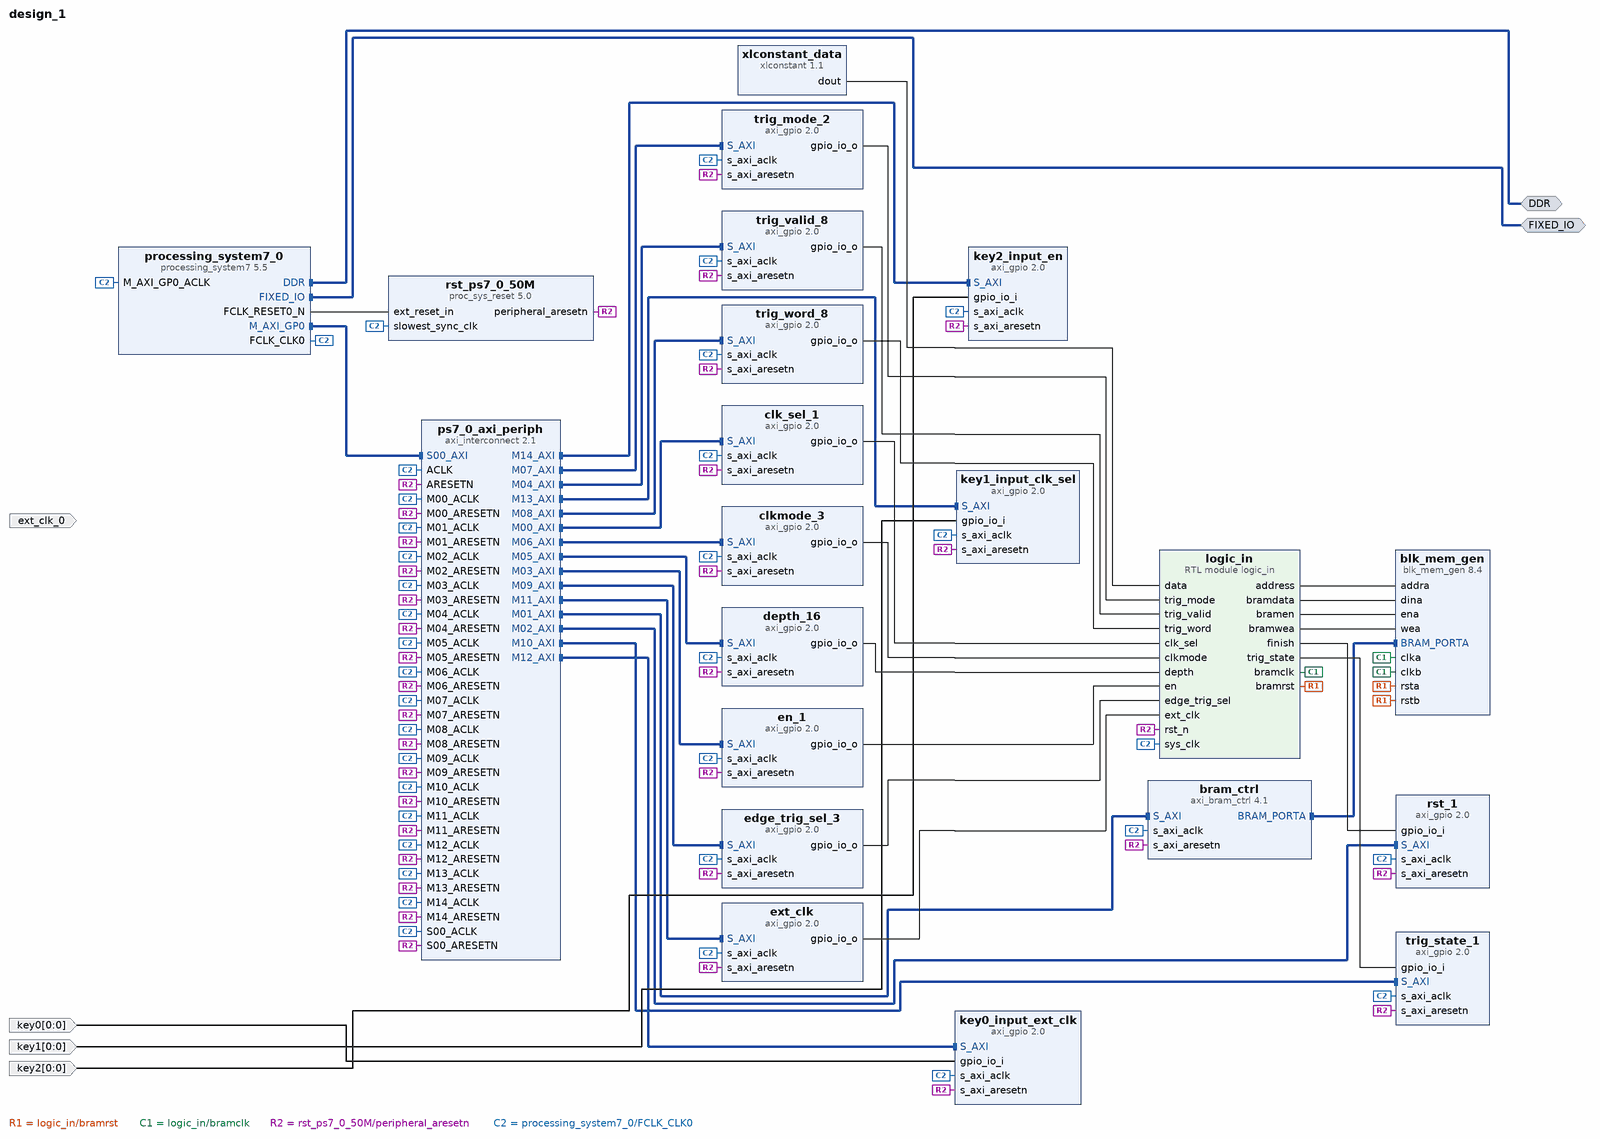
[diagram p0: block diagram of the top level]
# Vivado block design design_1, xc7z020clg400-1, Vivado 2018.3
create_bd_design design_1

create_bd_intf_port -mode Master -vlnv xilinx.com:interface:ddrx_rtl:1.0 DDR
create_bd_intf_port -mode Master -vlnv xilinx.com:display_processing_system7:fixedio_rtl:1.0 FIXED_IO
create_bd_port -dir I -type clk ext_clk_0
create_bd_port -dir I -from 0 -to 0 key0
create_bd_port -dir I -from 0 -to 0 key1
create_bd_port -dir I -from 0 -to 0 key2

create_bd_cell -type ip -vlnv xilinx.com:ip:blk_mem_gen:8.4 blk_mem_gen
set_property -dict [list \
  CONFIG.EN_SAFETY_CKT false \
  CONFIG.Enable_B Use_ENB_Pin \
  CONFIG.Memory_Type True_Dual_Port_RAM \
  CONFIG.Port_B_Clock 100 \
  CONFIG.Port_B_Enable_Rate 100 \
  CONFIG.Port_B_Write_Rate 50 \
  CONFIG.Use_RSTB_Pin true \
] [get_bd_cells blk_mem_gen]
create_bd_cell -type module -reference logic_in logic_in
create_bd_cell -type ip -vlnv xilinx.com:ip:axi_gpio:2.0 clk_sel_1
set_property -dict {CONFIG.C_ALL_OUTPUTS 1 CONFIG.C_GPIO_WIDTH 1} [get_bd_cells clk_sel_1]
create_bd_cell -type ip -vlnv xilinx.com:ip:processing_system7:5.5 processing_system7_0
set_property -dict [list \
  CONFIG.PCW_APU_PERIPHERAL_FREQMHZ 650 \
  CONFIG.PCW_CRYSTAL_PERIPHERAL_FREQMHZ 50 \
  CONFIG.PCW_ENET0_ENET0_IO {MIO 16 .. 27} \
  CONFIG.PCW_ENET0_GRP_MDIO_ENABLE 1 \
  CONFIG.PCW_ENET0_GRP_MDIO_IO {MIO 52 .. 53} \
  CONFIG.PCW_ENET0_PERIPHERAL_ENABLE 1 \
  CONFIG.PCW_ENET0_RESET_ENABLE 1 \
  CONFIG.PCW_ENET0_RESET_IO {MIO 9} \
  CONFIG.PCW_ENET_RESET_ENABLE 1 \
  CONFIG.PCW_ENET_RESET_SELECT {Share reset pin} \
  CONFIG.PCW_FPGA0_PERIPHERAL_FREQMHZ 100 \
  CONFIG.PCW_FPGA1_PERIPHERAL_FREQMHZ 50 \
  CONFIG.PCW_GPIO_MIO_GPIO_ENABLE 1 \
  CONFIG.PCW_GPIO_MIO_GPIO_IO MIO \
  CONFIG.PCW_I2C_RESET_ENABLE 0 \
  CONFIG.PCW_M_AXI_GP0_FREQMHZ 10 \
  CONFIG.PCW_PERIPHERAL_BOARD_PRESET None \
  CONFIG.PCW_PRESET_BANK1_VOLTAGE {LVCMOS 1.8V} \
  CONFIG.PCW_QSPI_GRP_FBCLK_ENABLE 1 \
  CONFIG.PCW_QSPI_GRP_FBCLK_IO {MIO 8} \
  CONFIG.PCW_QSPI_GRP_SINGLE_SS_ENABLE 1 \
  CONFIG.PCW_QSPI_GRP_SINGLE_SS_IO {MIO 1 .. 6} \
  CONFIG.PCW_QSPI_PERIPHERAL_ENABLE 1 \
  CONFIG.PCW_QSPI_QSPI_IO {MIO 1 .. 6} \
  CONFIG.PCW_SD0_GRP_CD_ENABLE 1 \
  CONFIG.PCW_SD0_GRP_CD_IO {MIO 47} \
  CONFIG.PCW_SD0_GRP_WP_ENABLE 0 \
  CONFIG.PCW_SD0_PERIPHERAL_ENABLE 1 \
  CONFIG.PCW_SD0_SD0_IO {MIO 40 .. 45} \
  CONFIG.PCW_SDIO_PERIPHERAL_FREQMHZ 50 \
  CONFIG.PCW_SINGLE_QSPI_DATA_MODE x4 \
  CONFIG.PCW_UART0_PERIPHERAL_ENABLE 1 \
  CONFIG.PCW_UART0_UART0_IO {MIO 14 .. 15} \
  CONFIG.PCW_UART1_PERIPHERAL_ENABLE 0 \
  CONFIG.PCW_UART_PERIPHERAL_FREQMHZ 100 \
  CONFIG.PCW_UIPARAM_DDR_BUS_WIDTH {16 Bit} \
  CONFIG.PCW_UIPARAM_DDR_FREQ_MHZ 525 \
  CONFIG.PCW_UIPARAM_DDR_PARTNO {MT41J256M16 RE-125} \
  CONFIG.PCW_USB0_PERIPHERAL_ENABLE 1 \
  CONFIG.PCW_USB0_RESET_ENABLE 1 \
  CONFIG.PCW_USB0_RESET_IO {MIO 46} \
  CONFIG.PCW_USB0_USB0_IO {MIO 28 .. 39} \
  CONFIG.PCW_USB_RESET_ENABLE 1 \
  CONFIG.PCW_USB_RESET_SELECT {Share reset pin} \
] [get_bd_cells processing_system7_0]
# 491 more settings of processing_system7_0 are not shown: defaults, MIO pin electricals, DDR timing, and values the tool derives
create_bd_cell -type ip -vlnv xilinx.com:ip:axi_interconnect:2.1 ps7_0_axi_periph
set_property -dict {CONFIG.NUM_MI 15} [get_bd_cells ps7_0_axi_periph]
create_bd_cell -type ip -vlnv xilinx.com:ip:proc_sys_reset:5.0 rst_ps7_0_50M
create_bd_cell -type ip -vlnv xilinx.com:ip:axi_bram_ctrl:4.1 bram_ctrl
set_property -dict {CONFIG.SINGLE_PORT_BRAM 1} [get_bd_cells bram_ctrl]
create_bd_cell -type ip -vlnv xilinx.com:ip:axi_gpio:2.0 rst_1
set_property -dict {CONFIG.C_ALL_INPUTS 1 CONFIG.C_GPIO_WIDTH 1} [get_bd_cells rst_1]
create_bd_cell -type ip -vlnv xilinx.com:ip:axi_gpio:2.0 en_1
set_property -dict {CONFIG.C_ALL_OUTPUTS 1 CONFIG.C_GPIO_WIDTH 1} [get_bd_cells en_1]
create_bd_cell -type ip -vlnv xilinx.com:ip:axi_gpio:2.0 trig_valid_8
set_property -dict {CONFIG.C_ALL_OUTPUTS 1 CONFIG.C_GPIO_WIDTH 8} [get_bd_cells trig_valid_8]
create_bd_cell -type ip -vlnv xilinx.com:ip:axi_gpio:2.0 depth_16
set_property -dict {CONFIG.C_ALL_INPUTS 0 CONFIG.C_ALL_OUTPUTS 1 CONFIG.C_GPIO_WIDTH 16} [get_bd_cells depth_16]
create_bd_cell -type ip -vlnv xilinx.com:ip:axi_gpio:2.0 clkmode_3
set_property -dict {CONFIG.C_ALL_OUTPUTS 1 CONFIG.C_GPIO_WIDTH 3} [get_bd_cells clkmode_3]
create_bd_cell -type ip -vlnv xilinx.com:ip:xlconstant:1.1 xlconstant_data
set_property -dict {CONFIG.CONST_VAL 132 CONFIG.CONST_WIDTH 8} [get_bd_cells xlconstant_data]
create_bd_cell -type ip -vlnv xilinx.com:ip:axi_gpio:2.0 trig_mode_2
set_property -dict {CONFIG.C_ALL_OUTPUTS 1 CONFIG.C_GPIO_WIDTH 2} [get_bd_cells trig_mode_2]
create_bd_cell -type ip -vlnv xilinx.com:ip:axi_gpio:2.0 trig_word_8
set_property -dict {CONFIG.C_ALL_OUTPUTS 1 CONFIG.C_GPIO_WIDTH 8} [get_bd_cells trig_word_8]
create_bd_cell -type ip -vlnv xilinx.com:ip:axi_gpio:2.0 edge_trig_sel_3
set_property -dict {CONFIG.C_ALL_OUTPUTS 1 CONFIG.C_GPIO_WIDTH 3} [get_bd_cells edge_trig_sel_3]
create_bd_cell -type ip -vlnv xilinx.com:ip:axi_gpio:2.0 trig_state_1
set_property -dict {CONFIG.C_ALL_INPUTS 1 CONFIG.C_GPIO_WIDTH 1} [get_bd_cells trig_state_1]
create_bd_cell -type ip -vlnv xilinx.com:ip:axi_gpio:2.0 ext_clk
set_property -dict {CONFIG.C_ALL_OUTPUTS 1 CONFIG.C_GPIO_WIDTH 1} [get_bd_cells ext_clk]
create_bd_cell -type ip -vlnv xilinx.com:ip:axi_gpio:2.0 key0_input_ext_clk
set_property -dict {CONFIG.C_ALL_INPUTS 1 CONFIG.C_GPIO_WIDTH 1} [get_bd_cells key0_input_ext_clk]
create_bd_cell -type ip -vlnv xilinx.com:ip:axi_gpio:2.0 key1_input_clk_sel
set_property -dict {CONFIG.C_ALL_INPUTS 1 CONFIG.C_GPIO_WIDTH 1} [get_bd_cells key1_input_clk_sel]
create_bd_cell -type ip -vlnv xilinx.com:ip:axi_gpio:2.0 key2_input_en
set_property -dict {CONFIG.C_ALL_INPUTS 1 CONFIG.C_GPIO_WIDTH 1} [get_bd_cells key2_input_en]

# ---- connections ----

connect_bd_intf_net [get_bd_intf_pins ps7_0_axi_periph/M06_AXI] [get_bd_intf_pins clkmode_3/S_AXI]
connect_bd_intf_net [get_bd_intf_pins ps7_0_axi_periph/M03_AXI] [get_bd_intf_pins en_1/S_AXI]
connect_bd_intf_net [get_bd_intf_pins processing_system7_0/M_AXI_GP0] [get_bd_intf_pins ps7_0_axi_periph/S00_AXI]
connect_bd_intf_net [get_bd_intf_pins ps7_0_axi_periph/M02_AXI] [get_bd_intf_pins rst_1/S_AXI]
connect_bd_intf_net [get_bd_intf_pins ps7_0_axi_periph/M00_AXI] [get_bd_intf_pins clk_sel_1/S_AXI]
connect_bd_intf_net -intf_net axi_bram_ctrl_0_BRAM_PORTA [get_bd_intf_pins blk_mem_gen/BRAM_PORTA] [get_bd_intf_pins bram_ctrl/BRAM_PORTA]
connect_bd_intf_net [get_bd_intf_ports DDR] [get_bd_intf_pins processing_system7_0/DDR]
connect_bd_intf_net [get_bd_intf_pins ps7_0_axi_periph/M01_AXI] [get_bd_intf_pins bram_ctrl/S_AXI]
connect_bd_intf_net [get_bd_intf_ports FIXED_IO] [get_bd_intf_pins processing_system7_0/FIXED_IO]
connect_bd_intf_net [get_bd_intf_pins ps7_0_axi_periph/M08_AXI] [get_bd_intf_pins trig_word_8/S_AXI]
connect_bd_intf_net [get_bd_intf_pins ps7_0_axi_periph/M04_AXI] [get_bd_intf_pins trig_valid_8/S_AXI]
connect_bd_intf_net [get_bd_intf_pins ps7_0_axi_periph/M09_AXI] [get_bd_intf_pins edge_trig_sel_3/S_AXI]
connect_bd_intf_net [get_bd_intf_pins ps7_0_axi_periph/M07_AXI] [get_bd_intf_pins trig_mode_2/S_AXI]
connect_bd_intf_net [get_bd_intf_pins ps7_0_axi_periph/M10_AXI] [get_bd_intf_pins trig_state_1/S_AXI]
connect_bd_intf_net [get_bd_intf_pins ps7_0_axi_periph/M05_AXI] [get_bd_intf_pins depth_16/S_AXI]
connect_bd_intf_net [get_bd_intf_pins ps7_0_axi_periph/M11_AXI] [get_bd_intf_pins ext_clk/S_AXI]
connect_bd_intf_net [get_bd_intf_pins ps7_0_axi_periph/M12_AXI] [get_bd_intf_pins key0_input_ext_clk/S_AXI]
connect_bd_intf_net [get_bd_intf_pins ps7_0_axi_periph/M13_AXI] [get_bd_intf_pins key1_input_clk_sel/S_AXI]
connect_bd_intf_net [get_bd_intf_pins ps7_0_axi_periph/M14_AXI] [get_bd_intf_pins key2_input_en/S_AXI]
connect_bd_net -net logic_in_0_address [get_bd_pins logic_in/address] [get_bd_pins blk_mem_gen/addra]
connect_bd_net -net logic_in_0_bramdata [get_bd_pins logic_in/bramdata] [get_bd_pins blk_mem_gen/dina]
connect_bd_net -net logic_in_0_bramen [get_bd_pins logic_in/bramen] [get_bd_pins blk_mem_gen/ena]
connect_bd_net -net logic_in_0_bramwea [get_bd_pins logic_in/bramwea] [get_bd_pins blk_mem_gen/wea]
connect_bd_net -net logic_in_0_bramrst [get_bd_pins logic_in/bramrst] [get_bd_pins blk_mem_gen/rsta] [get_bd_pins blk_mem_gen/rstb]
connect_bd_net -net logic_in_0_bramclk [get_bd_pins logic_in/bramclk] [get_bd_pins blk_mem_gen/clka] [get_bd_pins blk_mem_gen/clkb]
connect_bd_net [get_bd_pins processing_system7_0/FCLK_RESET0_N] [get_bd_pins rst_ps7_0_50M/ext_reset_in]
connect_bd_net [get_bd_pins rst_ps7_0_50M/peripheral_aresetn] \
  [get_bd_pins ps7_0_axi_periph/S00_ARESETN] [get_bd_pins clk_sel_1/s_axi_aresetn] [get_bd_pins ps7_0_axi_periph/M00_ARESETN] \
  [get_bd_pins ps7_0_axi_periph/ARESETN] [get_bd_pins bram_ctrl/s_axi_aresetn] [get_bd_pins ps7_0_axi_periph/M01_ARESETN] \
  [get_bd_pins rst_1/s_axi_aresetn] [get_bd_pins ps7_0_axi_periph/M02_ARESETN] [get_bd_pins en_1/s_axi_aresetn] \
  [get_bd_pins ps7_0_axi_periph/M03_ARESETN] [get_bd_pins trig_valid_8/s_axi_aresetn] \
  [get_bd_pins ps7_0_axi_periph/M04_ARESETN] [get_bd_pins depth_16/s_axi_aresetn] [get_bd_pins ps7_0_axi_periph/M05_ARESETN] \
  [get_bd_pins clkmode_3/s_axi_aresetn] [get_bd_pins ps7_0_axi_periph/M06_ARESETN] [get_bd_pins trig_mode_2/s_axi_aresetn] \
  [get_bd_pins ps7_0_axi_periph/M07_ARESETN] [get_bd_pins trig_word_8/s_axi_aresetn] \
  [get_bd_pins ps7_0_axi_periph/M08_ARESETN] [get_bd_pins edge_trig_sel_3/s_axi_aresetn] \
  [get_bd_pins ps7_0_axi_periph/M09_ARESETN] [get_bd_pins logic_in/rst_n] [get_bd_pins trig_state_1/s_axi_aresetn] \
  [get_bd_pins ps7_0_axi_periph/M10_ARESETN] [get_bd_pins ext_clk/s_axi_aresetn] [get_bd_pins ps7_0_axi_periph/M11_ARESETN] \
  [get_bd_pins key0_input_ext_clk/s_axi_aresetn] [get_bd_pins ps7_0_axi_periph/M12_ARESETN] \
  [get_bd_pins key1_input_clk_sel/s_axi_aresetn] [get_bd_pins ps7_0_axi_periph/M13_ARESETN] \
  [get_bd_pins key2_input_en/s_axi_aresetn] [get_bd_pins ps7_0_axi_periph/M14_ARESETN]
connect_bd_net -net axi_gpio_0_gpio_io_o [get_bd_pins clk_sel_1/gpio_io_o] [get_bd_pins logic_in/clk_sel]
connect_bd_net -net axi_gpio_en_gpio_io_o [get_bd_pins en_1/gpio_io_o] [get_bd_pins logic_in/en]
connect_bd_net -net axi_gpio_depth_gpio_io_o [get_bd_pins depth_16/gpio_io_o] [get_bd_pins logic_in/depth]
connect_bd_net -net axi_gpio_clkmode_gpio_io_o [get_bd_pins clkmode_3/gpio_io_o] [get_bd_pins logic_in/clkmode]
connect_bd_net -net axi_gpio_trig_valid_gpio_io_o [get_bd_pins trig_valid_8/gpio_io_o] [get_bd_pins logic_in/trig_valid]
connect_bd_net -net xlconstant_0_dout [get_bd_pins xlconstant_data/dout] [get_bd_pins logic_in/data]
connect_bd_net -net axi_gpio_trig_mode_gpio_io_o [get_bd_pins trig_mode_2/gpio_io_o] [get_bd_pins logic_in/trig_mode]
connect_bd_net -net axi_gpio_0_gpio_io_o2 [get_bd_pins trig_word_8/gpio_io_o] [get_bd_pins logic_in/trig_word]
connect_bd_net -net axi_gpio_trig_sel_gpio_io_o [get_bd_pins edge_trig_sel_3/gpio_io_o] [get_bd_pins logic_in/edge_trig_sel]
connect_bd_net -net logic_in_0_finish [get_bd_pins logic_in/finish] [get_bd_pins rst_1/gpio_io_i]
connect_bd_net -net logic_in_0_trig_state [get_bd_pins logic_in/trig_state] [get_bd_pins trig_state_1/gpio_io_i]
connect_bd_net [get_bd_pins processing_system7_0/FCLK_CLK0] \
  [get_bd_pins logic_in/sys_clk] [get_bd_pins clk_sel_1/s_axi_aclk] [get_bd_pins ps7_0_axi_periph/M00_ACLK] \
  [get_bd_pins processing_system7_0/M_AXI_GP0_ACLK] [get_bd_pins ps7_0_axi_periph/S00_ACLK] \
  [get_bd_pins ps7_0_axi_periph/ACLK] [get_bd_pins ps7_0_axi_periph/M01_ACLK] [get_bd_pins bram_ctrl/s_axi_aclk] \
  [get_bd_pins ps7_0_axi_periph/M02_ACLK] [get_bd_pins rst_1/s_axi_aclk] [get_bd_pins ps7_0_axi_periph/M03_ACLK] \
  [get_bd_pins en_1/s_axi_aclk] [get_bd_pins ps7_0_axi_periph/M04_ACLK] [get_bd_pins trig_valid_8/s_axi_aclk] \
  [get_bd_pins ps7_0_axi_periph/M05_ACLK] [get_bd_pins depth_16/s_axi_aclk] [get_bd_pins ps7_0_axi_periph/M06_ACLK] \
  [get_bd_pins clkmode_3/s_axi_aclk] [get_bd_pins ps7_0_axi_periph/M07_ACLK] [get_bd_pins trig_mode_2/s_axi_aclk] \
  [get_bd_pins ps7_0_axi_periph/M08_ACLK] [get_bd_pins trig_word_8/s_axi_aclk] [get_bd_pins ps7_0_axi_periph/M09_ACLK] \
  [get_bd_pins edge_trig_sel_3/s_axi_aclk] [get_bd_pins ps7_0_axi_periph/M10_ACLK] [get_bd_pins trig_state_1/s_axi_aclk] \
  [get_bd_pins rst_ps7_0_50M/slowest_sync_clk] [get_bd_pins ext_clk/s_axi_aclk] [get_bd_pins ps7_0_axi_periph/M11_ACLK] \
  [get_bd_pins key0_input_ext_clk/s_axi_aclk] [get_bd_pins ps7_0_axi_periph/M12_ACLK] \
  [get_bd_pins key1_input_clk_sel/s_axi_aclk] [get_bd_pins ps7_0_axi_periph/M13_ACLK] [get_bd_pins key2_input_en/s_axi_aclk] \
  [get_bd_pins ps7_0_axi_periph/M14_ACLK]
connect_bd_net [get_bd_pins ext_clk/gpio_io_o] [get_bd_pins logic_in/ext_clk]
connect_bd_net -net gpio_io_i_0_1 [get_bd_ports key0] [get_bd_pins key0_input_ext_clk/gpio_io_i]
connect_bd_net -net gpio_io_i_0_2 [get_bd_ports key1] [get_bd_pins key1_input_clk_sel/gpio_io_i]
connect_bd_net -net gpio_io_i_0_3 [get_bd_ports key2] [get_bd_pins key2_input_en/gpio_io_i]
set_property HDL_ATTRIBUTE.BMM_INFO_PROCESSOR {arm > design_1 bram_ctrl} [get_bd_cells processing_system7_0]
set_property HDL_ATTRIBUTE.KEEP_HIERARCHY yes [get_bd_cells processing_system7_0]
set_property HDL_ATTRIBUTE.BMM_INFO_ADDRESS_SPACE {byte  0x40000000 32 > design_1 blk_mem_gen} [get_bd_cells bram_ctrl]
set_property HDL_ATTRIBUTE.KEEP_HIERARCHY yes [get_bd_cells bram_ctrl]

# ---- address map ----
assign_bd_address -offset 0x40000000 -range 8K -target_address_space [get_bd_addr_spaces processing_system7_0/Data] [get_bd_addr_segs bram_ctrl/S_AXI/Mem0]
assign_bd_address -offset 0x41200000 -range 64K -target_address_space [get_bd_addr_spaces processing_system7_0/Data] [get_bd_addr_segs clk_sel_1/S_AXI/Reg]
assign_bd_address -offset 0x41210000 -range 64K -target_address_space [get_bd_addr_spaces processing_system7_0/Data] [get_bd_addr_segs rst_1/S_AXI/Reg]
assign_bd_address -offset 0x41220000 -range 64K -target_address_space [get_bd_addr_spaces processing_system7_0/Data] [get_bd_addr_segs en_1/S_AXI/Reg]
assign_bd_address -offset 0x41230000 -range 64K -target_address_space [get_bd_addr_spaces processing_system7_0/Data] [get_bd_addr_segs trig_valid_8/S_AXI/Reg]
assign_bd_address -offset 0x41240000 -range 64K -target_address_space [get_bd_addr_spaces processing_system7_0/Data] [get_bd_addr_segs depth_16/S_AXI/Reg]
assign_bd_address -offset 0x41250000 -range 64K -target_address_space [get_bd_addr_spaces processing_system7_0/Data] [get_bd_addr_segs clkmode_3/S_AXI/Reg]
assign_bd_address -offset 0x41260000 -range 64K -target_address_space [get_bd_addr_spaces processing_system7_0/Data] [get_bd_addr_segs trig_mode_2/S_AXI/Reg]
assign_bd_address -offset 0x41270000 -range 64K -target_address_space [get_bd_addr_spaces processing_system7_0/Data] [get_bd_addr_segs trig_word_8/S_AXI/Reg]
assign_bd_address -offset 0x41280000 -range 64K -target_address_space [get_bd_addr_spaces processing_system7_0/Data] [get_bd_addr_segs edge_trig_sel_3/S_AXI/Reg]
assign_bd_address -offset 0x41290000 -range 64K -target_address_space [get_bd_addr_spaces processing_system7_0/Data] [get_bd_addr_segs trig_state_1/S_AXI/Reg]
assign_bd_address -offset 0x412A0000 -range 64K -target_address_space [get_bd_addr_spaces processing_system7_0/Data] [get_bd_addr_segs ext_clk/S_AXI/Reg]
assign_bd_address -offset 0x412B0000 -range 64K -target_address_space [get_bd_addr_spaces processing_system7_0/Data] [get_bd_addr_segs key0_input_ext_clk/S_AXI/Reg]
assign_bd_address -offset 0x412C0000 -range 64K -target_address_space [get_bd_addr_spaces processing_system7_0/Data] [get_bd_addr_segs key1_input_clk_sel/S_AXI/Reg]
assign_bd_address -offset 0x412D0000 -range 64K -target_address_space [get_bd_addr_spaces processing_system7_0/Data] [get_bd_addr_segs key2_input_en/S_AXI/Reg]

validate_bd_design
save_bd_design
